# Altium schematic sheet [05] - AUDIO.SchDoc: IMXBB
size A3; DocumentNumber: 5; Revision: 2.0; SheetNumber: 5; SheetTotal: 13
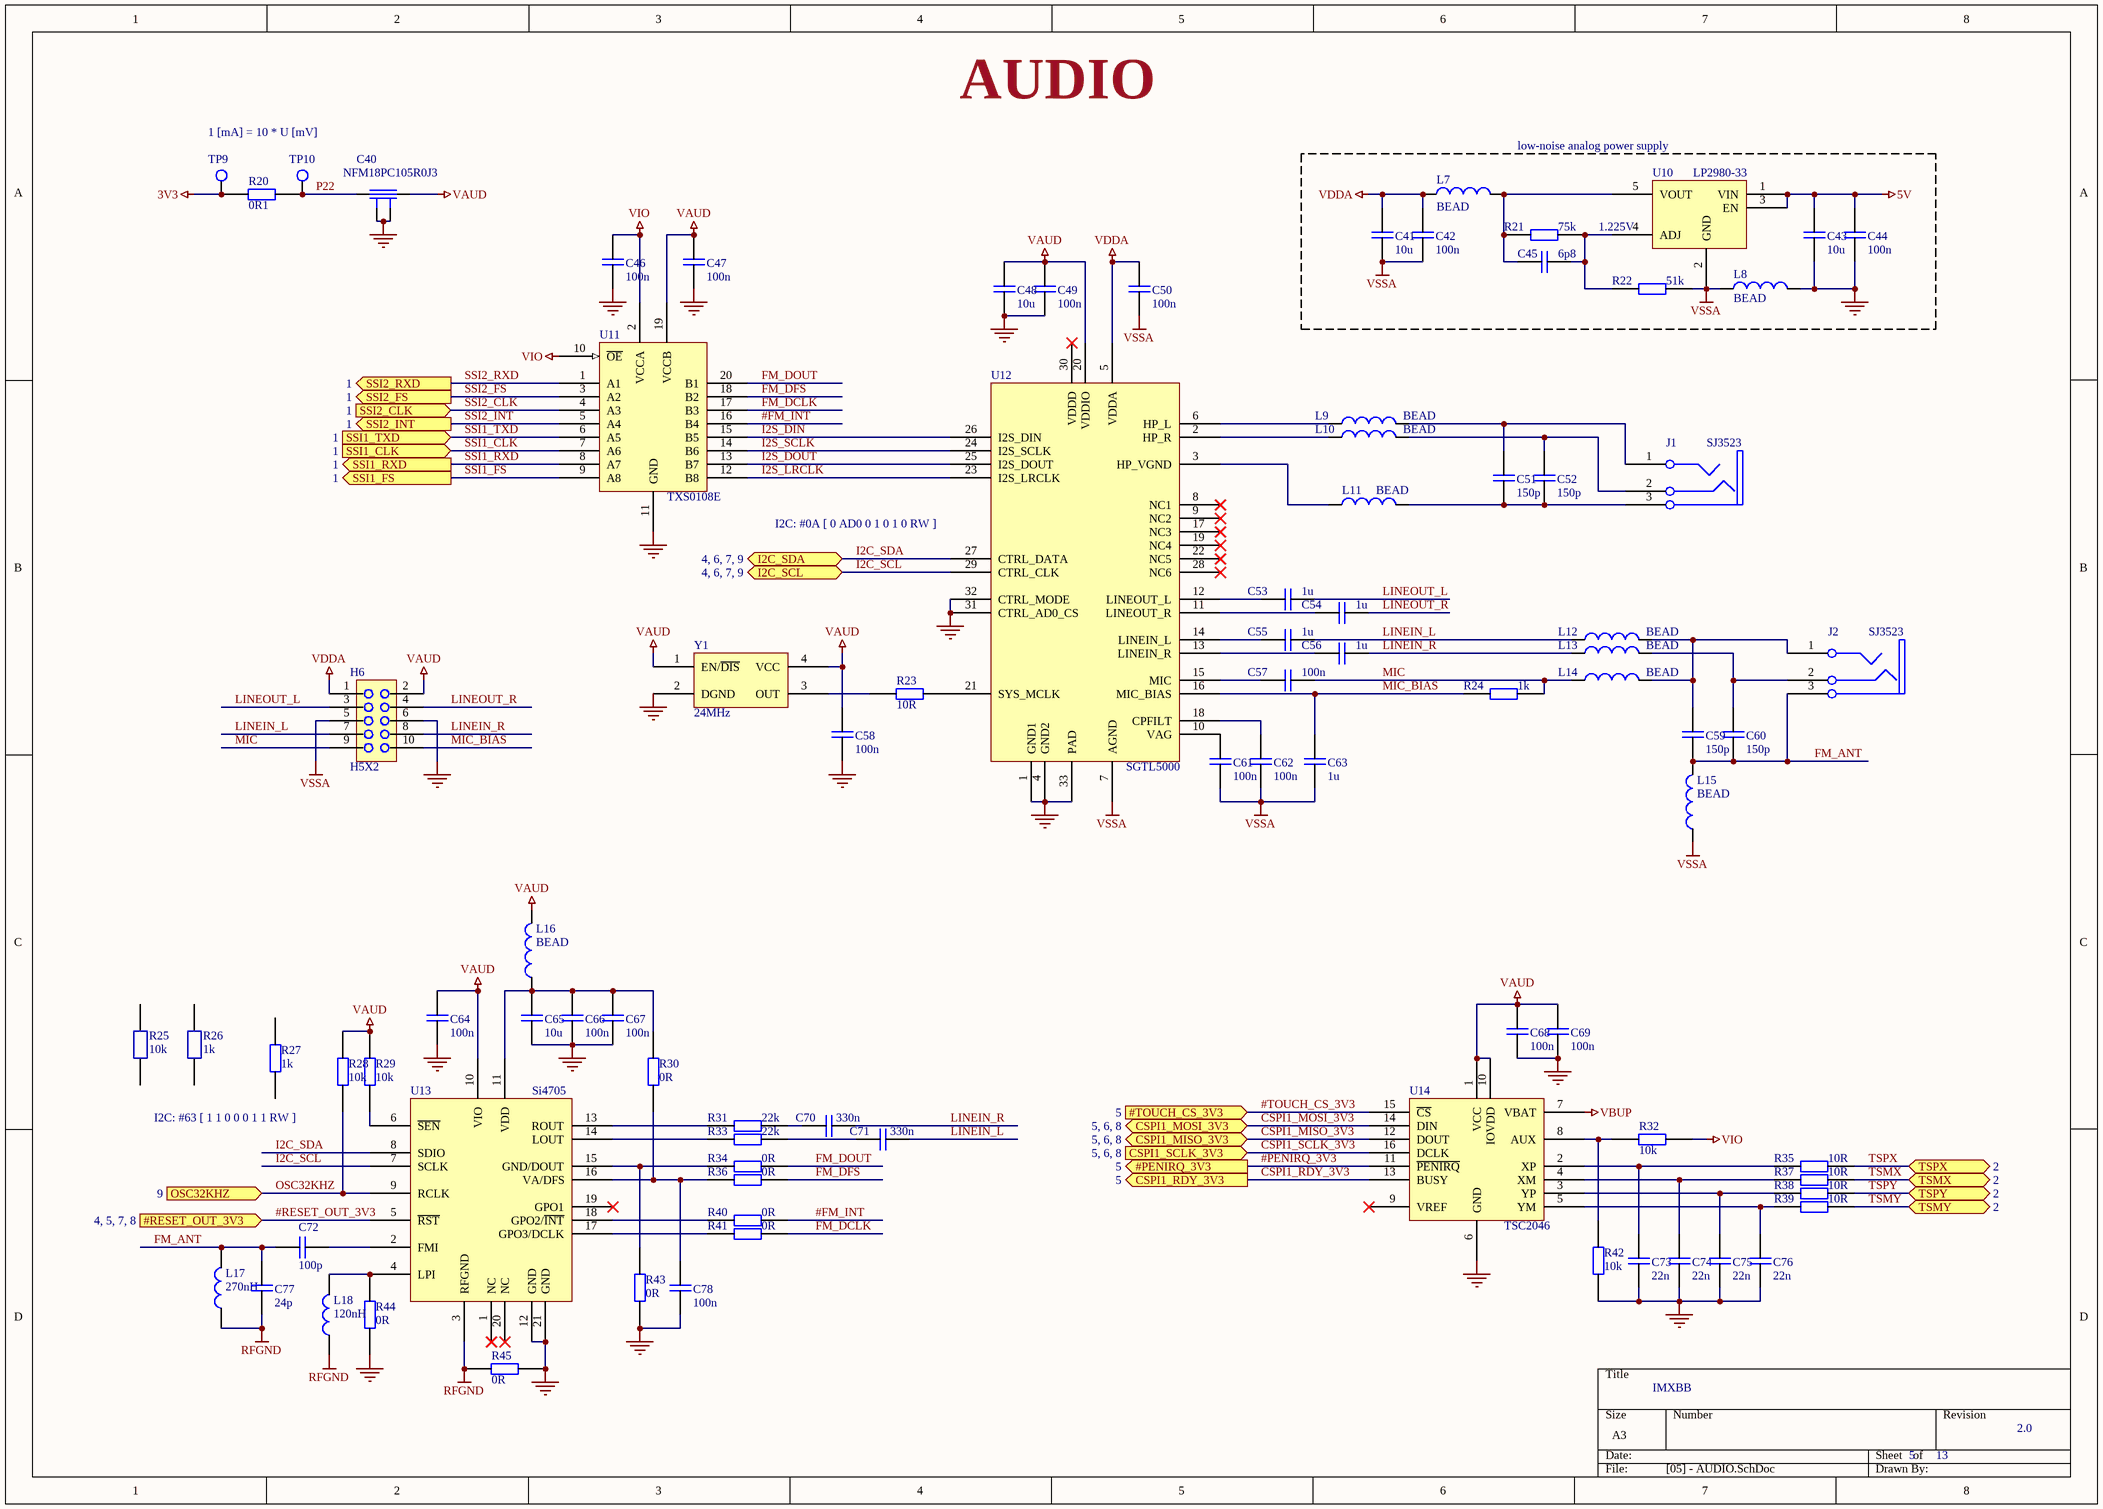
[diagram p0: [05] - AUDIO.SchDoc]

## Parts
C40  NFM18PC105R0J3  [NFM18P]
C41  10u  [0805]
C42  100n  [0603]
C43  10u  [0805]
C44  100n  [0603]
C45  6p8  [0603]
C46  100n  [0603]
C47  100n  [0603]
C48  10u  [0805]
C49  100n  [0603]
C50  100n  [0603]
C51  150p  [0603]
C52  150p  [0603]
C53  1u  [0603]
C54  1u  [0603]
C55  1u  [0603]
C56  1u  [0603]
C57  100n  [0603]
C58  100n  [0603]
C59  150p  [0603]
C60  150p  [0603]
C61  100n  [0603]
C62  100n  [0603]
C63  1u  [0603]
C64  100n  [0603]
C65  10u  [0805]
C66  100n  [0603]
C67  100n  [0603]
C68  100n  [0603]
C69  100n  [0603]
C70  330n  [0603]
C71  330n  [0603]
C72  100p  [0603]
C73  22n  [0603]
C74  22n  [0603]
C75  22n  [0603]
C76  22n  [0603]
C77  24p  [0603]
C78  100n  [0603]
H6  H5X2  [H2x5]
J1  SJ3523  [SJ35_NS]
J2  SJ3523  [SJ35_NS]
L7  BEAD  [0603]
L8  BEAD  [0603]
L9  BEAD  [0603]
L10  BEAD  [0603]
L11  BEAD  [0603]
L12  BEAD  [0603]
L13  BEAD  [0603]
L14  BEAD  [0603]
L15  BEAD  [0603]
L16  BEAD  [0603]
L17  270nH  [0603]
L18  120nH  [0603]
R20  0R1  [0603]
R21  75k  [0603]
R22  51k  [0603]
R23  10R  [0603]
R24  1k  [0603]
R25  10k
R26  1k
R27  1k  [0603]
R28  10k  [0603]
R29  10k  [0603]
R30  0R  [0603]
R31  22k  [0603]
R32  10k  [0603]
R33  22k  [0603]
R34  0R  [0603]
R35  10R  [0603]
R36  0R  [0603]
R37  10R  [0603]
R38  10R  [0603]
R39  10R  [0603]
R40  0R  [0603]
R41  0R  [0603]
R42  10k  [0603]
R43  0R  [0603]
R44  0R  [0603]
R45  0R  [0603]
TP9  TESTPOINT  [TESTPOINT_2mm]  (value not drawn)
TP10  TESTPOINT  [TESTPOINT_2mm]  (value not drawn)
U10  LP2980-33  [SOT23-5]
U11  TXS0108E  [TSSOP20]
U12  SGTL5000  [QFN32]
U13  Si4705  [QFN20]
U14  TSC2046  [TSSOP16]
Y1  24MHz  [JO75]

## Ports
#PENIRQ_3V3 (out, see 5), #RESET_OUT_3V3 (in, see 4, 5, 7, 8), #TOUCH_CS_3V3 (in, see 5), CSPI1_MISO_3V3 (bidir, see 5, 6, 8), CSPI1_MOSI_3V3 (bidir, see 5, 6, 8), CSPI1_RDY_3V3 (out, see 5), CSPI1_SCLK_3V3 (in, see 5, 6, 8), I2C_SCL (bidir, see 4, 6, 7, 9), I2C_SDA (bidir, see 4, 6, 7, 9), OSC32KHZ (in, see 9), SSI1_CLK (in, see 1), SSI1_FS (out, see 1), SSI1_RXD (out, see 1), SSI1_TXD (in, see 1), SSI2_CLK (in, see 1), SSI2_FS (out, see 1), SSI2_INT (out, see 1), SSI2_RXD (out, see 1), TSMX (see 2), TSMY (see 2), TSPX (see 2), TSPY (see 2)

## Nets
3V3: R20.1 TP9.1
5V: C43.2 C44.2 U10.1(VIN) U10.3(EN)
GND: C40.2 C40.4 C43.1 C44.1 C46.1 C47.1 C48.1 C49.1 C58.1 C64.1 C65.1 C66.1 C67.1 C68.1 C69.1 C73.1 C74.1 C75.1 C76.1 C78.1 H6.6 L8.1 R42.1 R43.1 R44.1 R45.1 U11.11(GND) U12.1(GND1) U12.4(GND2) U12.31(CTRL_AD0_CS) U12.32(CTRL_MODE) U12.33(PAD) U13.12(GND) U13.21(GND) U14.6(GND) Y1.2(DGND)
RFGND: C77.2 L17.1 L18.1 R45.2 U13.3(RFGND)
VAUD: C40.3 C47.2 C48.2 C49.2 C58.2 C64.2 C68.2 C69.2 H6.2 L16.2 R28.2 R29.2 U11.19(VCCB) U12.20(VDDIO) U13.10(VIO) U14.1(VCC) U14.10(IOVDD) Y1.1(EN/~{DIS}) Y1.4(VCC)
VBUP: U14.7(VBAT)
VDDA: C41.2 C42.2 C50.2 H6.1 L7.1 U12.5(VDDA)
VIO: C46.2 R32.1 U11.2(VCCA) U11.10(~{OE})
VSSA: C41.1 C42.1 C50.1 C61.1 C62.1 C63.2 H6.5 L8.2 L15.1 R22.1 U10.2(GND) U12.7(AGND)
#FM_INT: R40.1 U11.16(B4)
#PENIRQ_3V3: U14.11(~{PENIRQ}) ; port #PENIRQ_3V3
#RESET_OUT_3V3: U13.5(~{RST}) ; port #RESET_OUT_3V3
#TOUCH_CS_3V3: U14.15(~{CS}) ; port #TOUCH_CS_3V3
CSPI1_MISO_3V3: U14.12(DOUT) ; port CSPI1_MISO_3V3
CSPI1_MOSI_3V3: U14.14(DIN) ; port CSPI1_MOSI_3V3
CSPI1_RDY_3V3: U14.13(BUSY) ; port CSPI1_RDY_3V3
CSPI1_SCLK_3V3: U14.16(DCLK) ; port CSPI1_SCLK_3V3
FM_ANT: C59.1 C60.1 C72.2 C77.1 J2.3 L15.2 L17.2
FM_DCLK: R41.1 U11.17(B3)
FM_DFS: R36.1 U11.18(B2)
FM_DOUT: R34.1 U11.20(B1)
I2C_SCL: U12.29(CTRL_CLK) U13.7(SCLK) ; port I2C_SCL
I2C_SDA: U12.27(CTRL_DATA) U13.8(SDIO) ; port I2C_SDA
I2S_DIN: U11.15(B5) U12.26(I2S_DIN)
I2S_DOUT: U11.13(B7) U12.25(I2S_DOUT)
I2S_LRCLK: U11.12(B8) U12.23(I2S_LRCLK)
I2S_SCLK: U11.14(B6) U12.24(I2S_SCLK)
LINEIN_L: C55.1 C71.1 H6.7 L12.1
LINEIN_R: C56.1 C70.1 H6.8 L13.1
LINEOUT_L: C53.1 H6.3
LINEOUT_R: C54.1 H6.4
MIC: C57.1 H6.9 L14.1 R24.1
MIC_BIAS: C63.1 H6.10 R24.2 U12.16(MIC_BIAS)
OSC32KHZ: R28.1 U13.9(RCLK) ; port OSC32KHZ
P22: C40.1 R20.2 TP10.1
SSI1_CLK: U11.7(A6) ; port SSI1_CLK
SSI1_FS: U11.9(A8) ; port SSI1_FS
SSI1_RXD: U11.8(A7) ; port SSI1_RXD
SSI1_TXD: U11.6(A5) ; port SSI1_TXD
SSI2_CLK: U11.4(A3) ; port SSI2_CLK
SSI2_FS: U11.3(A2) ; port SSI2_FS
SSI2_INT: U11.5(A4) ; port SSI2_INT
SSI2_RXD: U11.1(A1) ; port SSI2_RXD
TSMX: R37.2 ; port TSMX
TSMY: R39.2 ; port TSMY
TSPX: R35.2 ; port TSPX
TSPY: R38.2 ; port TSPY
NetC45_1: C45.1 R21.1 R22.2 U10.4(ADJ)
NetC45_2: C45.2 L7.2 R21.2 U10.5(VOUT)
NetC51_1: C51.1 C52.1 J1.3 L11.2
NetC51_2: C51.2 J1.1 L9.2
NetC52_2: C52.2 J1.2 L10.2
NetC53_2: C53.2 U12.12(LINEOUT_L)
NetC54_2: C54.2 U12.11(LINEOUT_R)
NetC55_2: C55.2 U12.14(LINEIN_L)
NetC56_2: C56.2 U12.13(LINEIN_R)
NetC57_2: C57.2 U12.15(MIC)
NetC59_2: C59.2 J2.1 L12.2 L14.2
NetC60_2: C60.2 J2.2 L13.2
NetC61_2: C61.2 U12.10(VAG)
NetC62_2: C62.2 U12.18(CPFILT)
NetC65_2: C65.2 C66.2 C67.2 L16.1 R30.2 U13.11(VDD)
NetC70_2: C70.2 R31.1
NetC71_2: C71.2 R33.1
NetC72_1: C72.1 U13.2(FMI)
NetC73_2: C73.2 R35.1 U14.2(XP)
NetC74_2: C74.2 R37.1 U14.4(XM)
NetC75_2: C75.2 R38.1 U14.3(YP)
NetC76_2: C76.2 R39.1 U14.5(YM)
NetC78_2: C78.2 R30.1 R36.2 U13.16(VA/DFS)
NetL9_1: L9.1 U12.6(HP_L)
NetL10_1: L10.1 U12.2(HP_R)
NetL11_1: L11.1 U12.3(HP_VGND)
NetL18_2: L18.2 R44.2 U13.4(LPI)
NetR23_1: R23.1 Y1.3(OUT)
NetR23_2: R23.2 U12.21(SYS_MCLK)
NetR29_1: R29.1 U13.6(~{SEN})
NetR31_2: R31.2 U13.13(ROUT)
NetR32_2: R32.2 R42.2 U14.8(AUX)
NetR33_2: R33.2 U13.14(LOUT)
NetR34_2: R34.2 R43.2 U13.15(GND/DOUT)
NetR40_2: R40.2 U13.18(GPO2/~{INT})
NetR41_2: R41.2 U13.17(GPO3/DCLK)

Not connected (* = marked no-connect by the designer): R25 1 2; R26 1 2; R27 1 2; U12 8(NC1)* 9(NC2)* 17(NC3)* 19(NC4)* 22(NC5)* 28(NC6)* 30(VDDD)*; U13 1(NC)* 19(GPO1)* 20(NC)*; U14 9(VREF)*

## Notes on the sheet
- AUDIO
- 1 [mA] = 10 * U [mV]
- low-noise analog power supply
- (near U10) 1.225V
- (near U12) I2C: #0A [ 0 AD0 0 1 0 1 0 RW ]
- I2C: #63 [ 1 1 0 0 0 1 1 RW ]

## Library data of the parts
C40 = NFL21S: Chip EMIFIL; Producer: Murata; Order number: NFM18PC105R0J3; Component class: C; Assembly type: SMT
C41-C78 = C
L7-L16 = FBEAD
L17 L18 = L
R20-R24 R27-R45 = R
R25 = ERJ-3EKF1002V: RES 10.0K OHM 1/10W 1% 0603 SMD; Manufacturer: Panasonic Electronic Components; Power (Watts): 0.1W, 1/10W; Temperature Coefficient: ±100ppm/°C; Supplier 1: Digi-Key; Manufacturer Part Number: ERJ-3EKF1002V; RoHS: RoHS Compliant; Category: Resistors; Stock 1: 6966498; Pricing 1: 1=0.1, 50=0.0138, 100=0.0105, 250=0.0078, 500=0.00576, 1000=0.00384 (USD); Resistance (Ohms): 10k; Composition: Thick Film; Features: -; Tolerance: ±1%; Package / Case: 0603 (1608 Metric); Supplier Device Package: 0603; Size / Dimension: 0.063" L x 0.031" W (1.60mm x 0.80mm); Height: 0.022" (0.55mm); Number of Terminations: 2; Packaging: Cut Tape (CT); ComponentLink1URL: http://industrial.panasonic.com/www-cgi/jvcr13pz.cgi?E+PZ+3+AOA0002+ERJ3EKF1002V+7+WW; ComponentLink1Description: http://industrial.panasonic.com/www-cgi/jvcr13pz.cgi?E+PZ+3+AOA0002+ERJ3EKF1002V+7+WW; Supplier Part Number 1: P10.0KHCT-ND
R26 = ERJ-3EKF1001V: RES 1.00K OHM 1/10W 1% 0603 SMD; Manufacturer: Panasonic Electronic Components; Power (Watts): 0.1W, 1/10W; Temperature Coefficient: ±100ppm/°C; Supplier 1: Digi-Key; Manufacturer Part Number: ERJ-3EKF1001V; RoHS: RoHS Compliant; Category: Resistors; Stock 1: 7244544; Pricing 1: 1=0.1, 50=0.0138, 100=0.0105, 250=0.0078, 500=0.00576, 1000=0.00384 (USD); Resistance (Ohms): 1k; Composition: Thick Film; Features: -; Tolerance: ±1%; Package / Case: 0603 (1608 Metric); Supplier Device Package: 0603; Size / Dimension: 0.063" L x 0.031" W (1.60mm x 0.80mm); Height: 0.022" (0.55mm); Number of Terminations: 2; Packaging: Cut Tape (CT); ComponentLink1URL: http://industrial.panasonic.com/www-cgi/jvcr13pz.cgi?E+PZ+3+AOA0002+ERJ3EKF1001V+7+WW; ComponentLink1Description: http://industrial.panasonic.com/www-cgi/jvcr13pz.cgi?E+PZ+3+AOA0002+ERJ3EKF1001V+7+WW; Supplier Part Number 1: P1.00KHCT-ND
TP9 TP10 = TESTPOINT: Testpoint pad; Order number: no component; Component class: TP; Producer: n/a; Assembly type: no component
U10 = LP2980
U13 = Si470x
Y1 = OSC